# Altium schematic sheet Misc.SchDoc
size A4
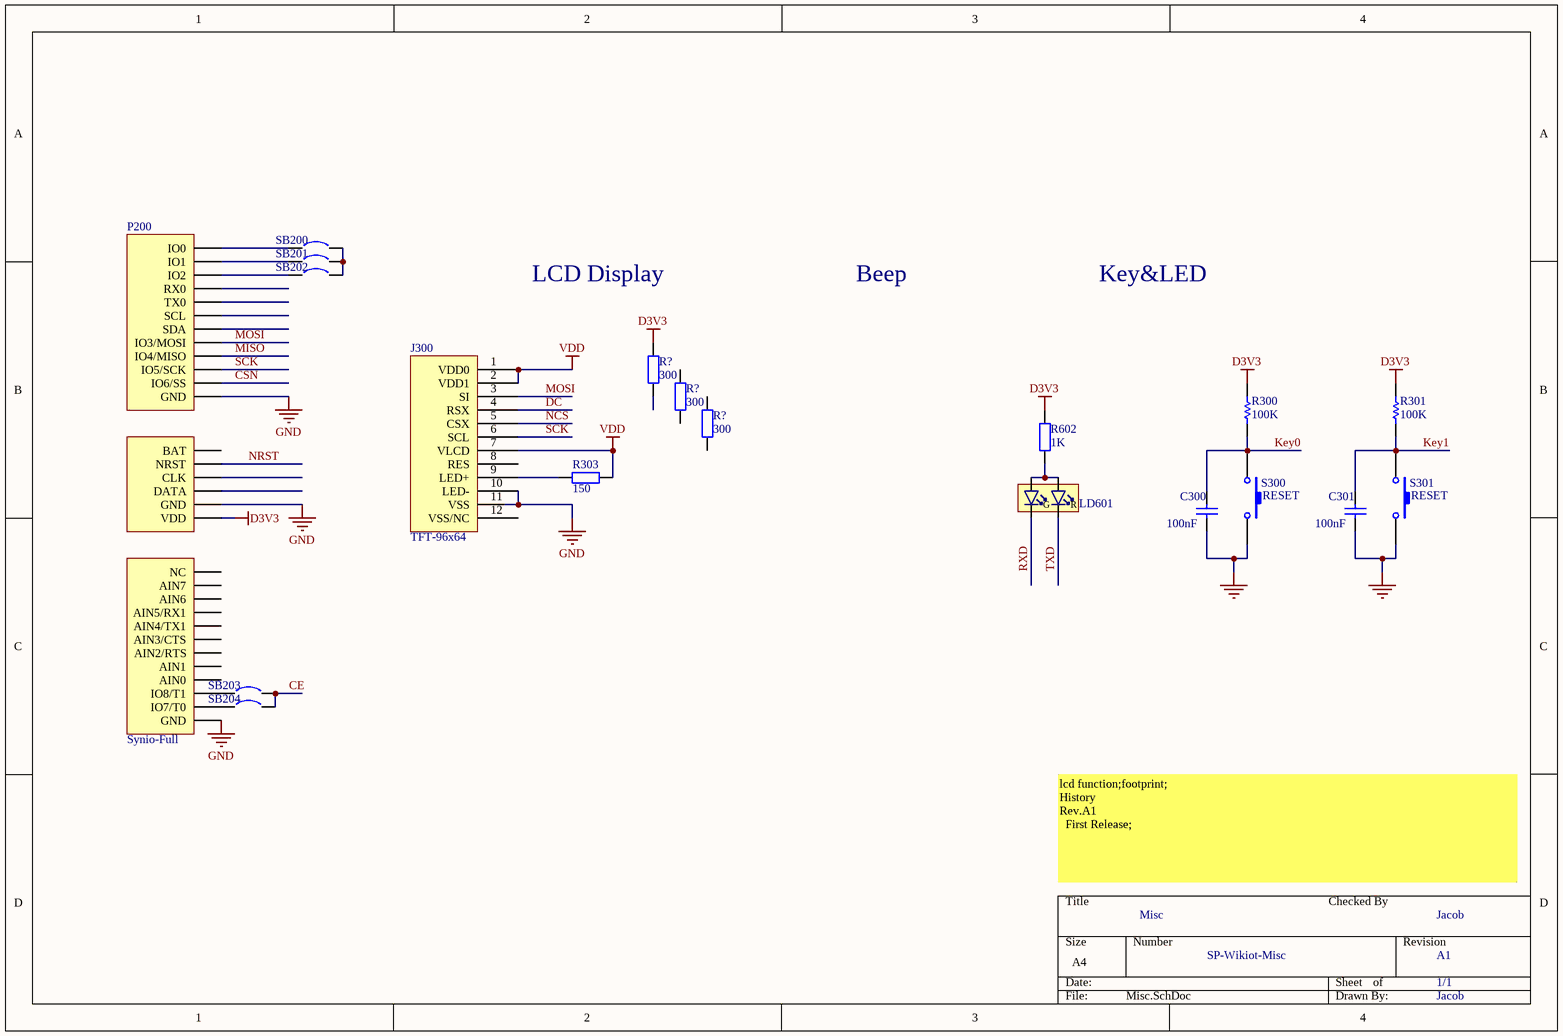
[diagram p0: Misc.SchDoc]

## Parts
(Parts that share a designator on the sheet are numbered #1, #2 ... from top to bottom, then left to right.)
C300  100nF  [0603M]
C301  100nF  [0603M]
J300  TFT-96x64  [TFT-PIN12-0.5]
LD601  LTST-C195KGJRKT  [0805-LED-Bi]  (value not drawn)
P200  Synio-Full  [Synio-Full]
R300  100K  [0603M]
R301  100K  [0603M]
R303  150  [0603M]
R602  1K  [0603M]
R?#1  300  [0603M]
R?#2  300  [0603M]
R?#3  300  [0603M]
S300  RESET  [KEY-2x4-SMD]
S301  RESET  [KEY-2x4-SMD]
SB200  Circuit Breaker  [JP2_SMD]  (value not drawn)
SB201  Circuit Breaker  [JP2_SMD]  (value not drawn)
SB202  Circuit Breaker  [JP2_SMD]  (value not drawn)
SB203  Circuit Breaker  [JP2_SMD]  (value not drawn)
SB204  Circuit Breaker  [JP2_SMD]  (value not drawn)

## Nets
D3V3: P200.18(VDD) R300.2 R301.2 R602.1 R?#1.1
GND: C300.1 C301.1 J300.10(LED-) J300.11(VSS) P200.12(GND) P200.17(GND) P200.19(GND) S300.1 S301.1
VDD: J300.1(VDD0) J300.2(VDD1) J300.7(VLCD) R303.2
CE: SB203.2 SB204.2
CSN: P200.11(IO6/SS)
DC: J300.4(RSX)
Key0: C300.2 R300.1 S300.2
Key1: C301.2 R301.1 S301.2
MISO: P200.9(IO4/MISO)
MOSI: J300.3(SI) P200.8(IO3/MOSI)
NCS: J300.5(CSX)
NRST: P200.14(NRST)
RXD: LD601.1(C1)
SCK: J300.6(SCL) P200.10(IO5/SCK)
TXD: LD601.2(C2)
NetJ300_9: J300.9(LED+) R303.1
NetLD601_3: LD601.3(A2) LD601.4(A1) R602.2
NetP200_1: P200.1(IO0) SB200.1
NetP200_2: P200.2(IO1) SB201.1
NetP200_3: P200.3(IO2) SB202.1
NetP200_20: P200.20(IO7/T0) SB204.1
NetP200_21: P200.21(IO8/T1) SB203.1
NetSB200_2: SB200.2 SB201.2 SB202.2

Not connected (* = marked no-connect by the designer): J300 8(RES) 12(VSS/NC); P200 4(RX0) 5(TX0) 6(SCL) 7(SDA) 13(BAT) 15(CLK) 16(DATA) 22(AIN0) 23(AIN1) 24(AIN2/RTS) 25(AIN3/CTS) 26(AIN4/TX1) 27(AIN5/RX1) 28(AIN6) 29(AIN7) 30(NC); R?#1 2; R?#2 1 2; R?#3 1 2

## Notes on the sheet
- LCD Display
- Beep
- Key&LED
- lcd function;footprint;
  History
  Rev.A1
  First Release;
- Misc
- Checked By
- Jacob
- SP-Wikiot-Misc
- A1
- 1/1
- (in symbol LED-DUAL) G; R

## Library data of the parts
C300 C301 = CAP: Capacitor; Published: 8-Jun-2000; Revision: July-2002: Re-released for DXP Platform.; Publisher: Altium Limited; Value: 100nF
LD601 = LED-DUAL: Avago, HSMF-A203 Bi-Color LED; Manufacturer: Lite-On Inc; 2nd source part number: 859-LTST-C195KGJRKT; Note: HSMF-A203- xxxxx GaP Red GaP Emerald Green; Artikkelnr Noca: 13019145; Part Number: LTST-C195KGJRKT; Manufacturer Part Number: LTST-C195KGJRKT; Datasheet: http://media.digikey.com/pdf/Data%20Sheets/Lite-On%20PDFs/LTST-C195KGJRKT.pdf; Footprint: LED_DUAL_0606; LatestRevisionDate: 2012-07-05; Pin Count: 4; Publisher: Nordic Semiconductor; Published: 2012-07-05; Value: LTST-C195KGJRKT; Supplier: Digi-Key; Supplier part number: 160-1452-1-ND; 2nd source Supplier: Mouser
P200 = Synio-Full: Synio-Full Header
R300 R301 = res1: Resistor; Fitted: NO; Published: 8-Jun-2000; Revision: July-2002: Re-released for DXP Platform.; Publisher: Altium Limited; Value: 100K
R303 R602 R?#1-R?#3 = Res2: Resistor; Published: 8-Jun-2000; LatestRevisionDate: 17-Jul-2002; LatestRevisionNote: Re-released for DXP Platform.; PackageReference: AXIAL-0.4; Publisher: Altium Limited
  R303: Value: 150
  R602: Value: 1K
  R?#1-R?#3: Value: 300
S300 S301 = SW-PB: Switch; Published: 24-Mar-1999; LatestRevisionDate: 17-Jul-2002; LatestRevisionNote: Re-released for DXP Platform.; PackageReference: SPST-2; Publisher: Altium Limited
SB200-SB204 = Circuit Breaker: Solder: YES; Published: 24-Mar-1999; Revision: July-2002: Re-released for DXP Platform.; Publisher: Altium Limited